# EAGLE design SSTuinoII_Jig (EAGLE 9.6.2)
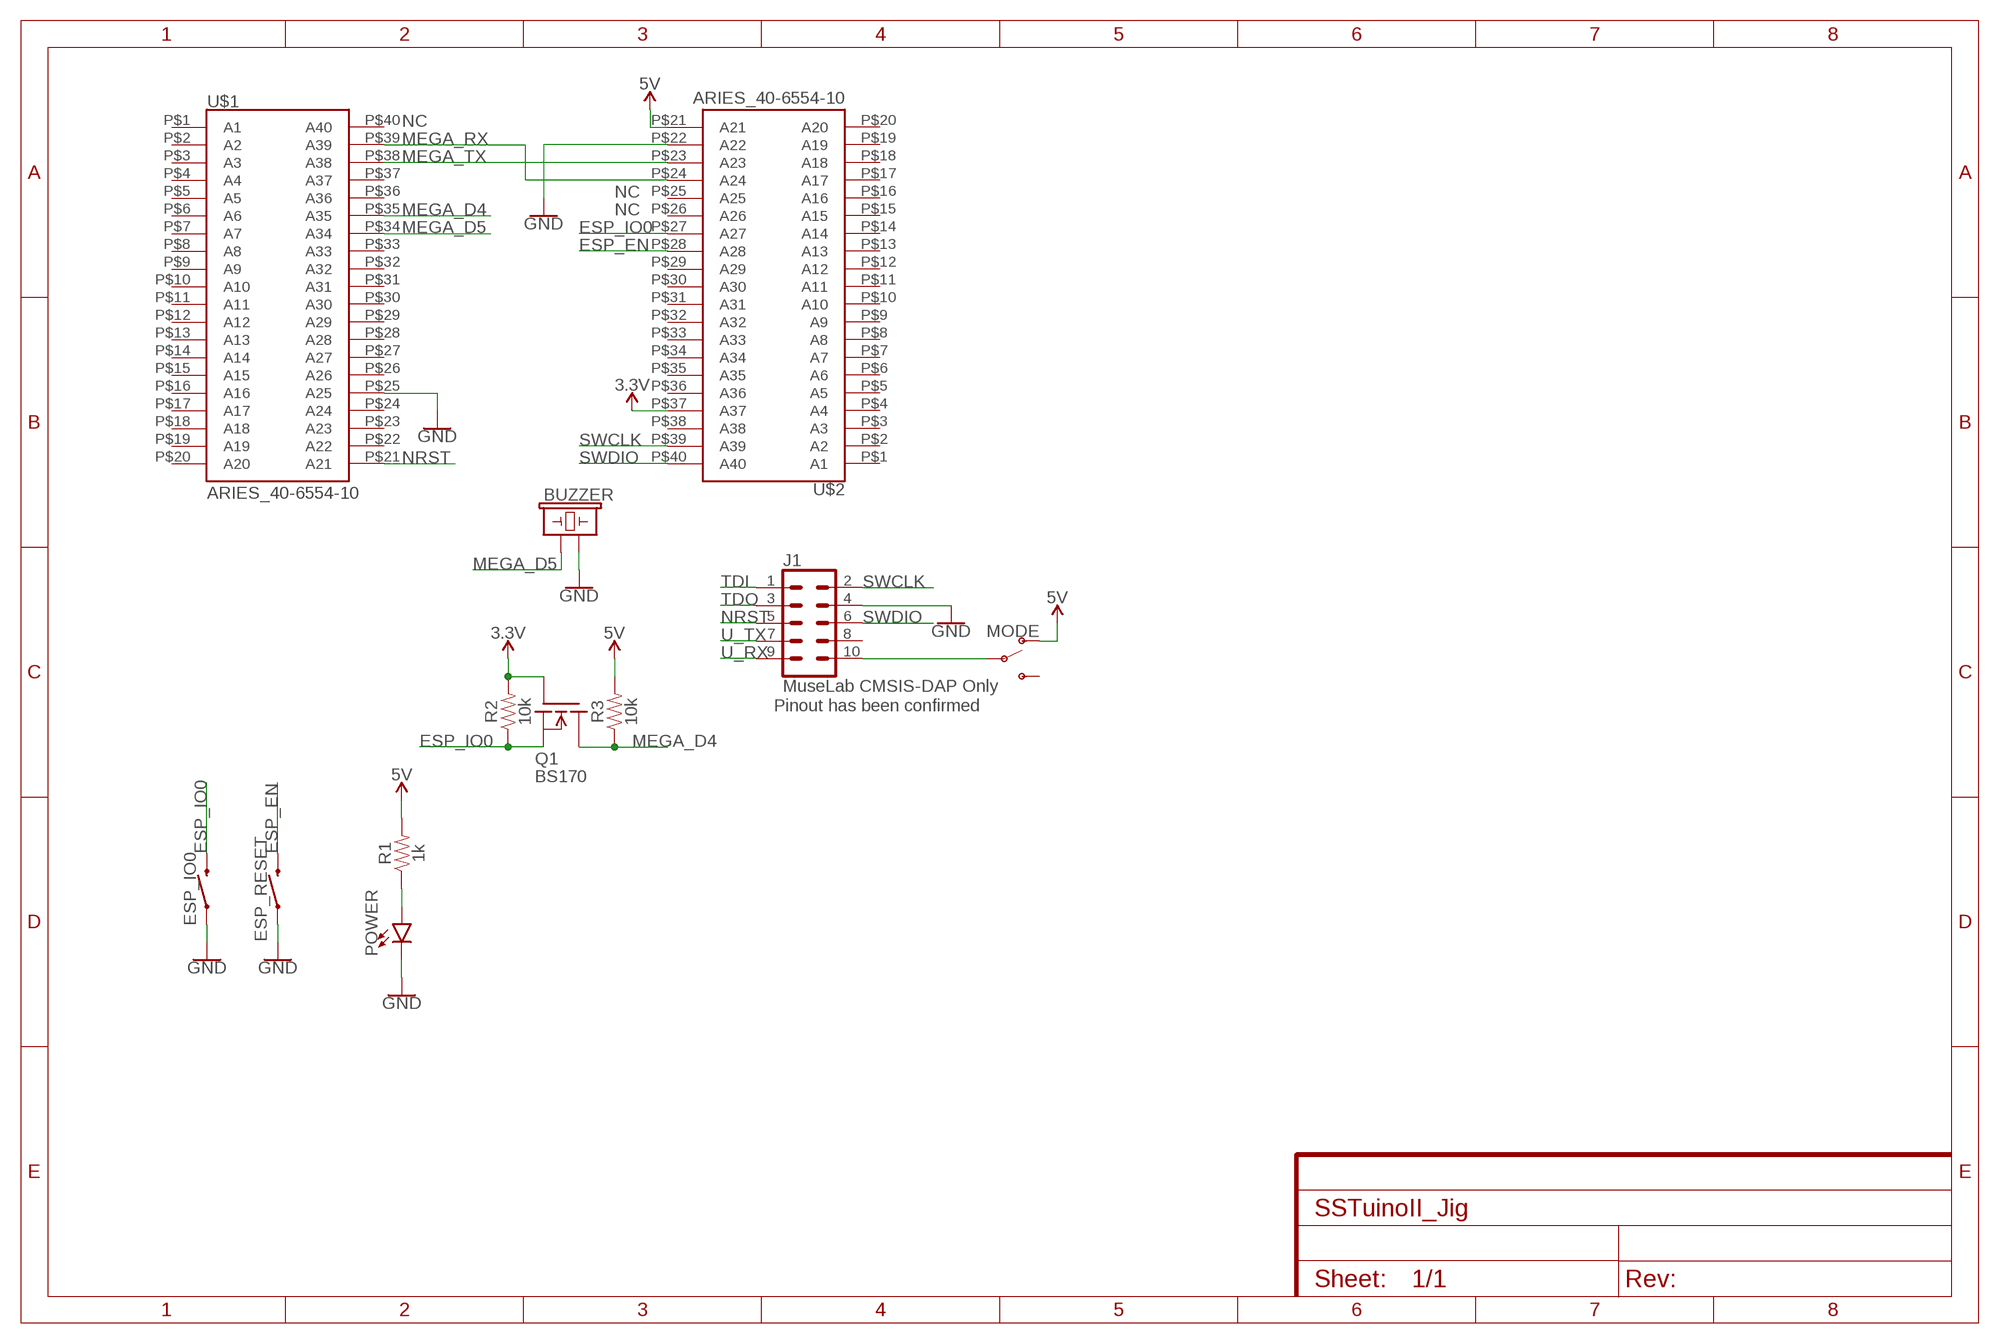
[diagram p0: schematic, sheet 1]

## Parts
BUZZER  BUZZER-PTH_KIT  [BUZZER-12MM-KIT]
ESP_IO0  MOMENTARY-SWITCH-SPST-PTH-6.0MM-KIT  [TACTILE_SWITCH_PTH_6.0MM_KIT]
ESP_RESET  MOMENTARY-SWITCH-SPST-PTH-6.0MM-KIT  [TACTILE_SWITCH_PTH_6.0MM_KIT]
J1  MuseLab CMSIS-DAP Only  CONN_05X2SHD_LOCK  [2X5-SHROUDED_LOCK]
MODE  SWITCH-SPDT-PTH-11.6X4.0MM-KIT  [SWITCH_SPDT_PTH_11.6X4.0MM_KIT]
POWER  LED3MM  [LED_3MM]
Q1  BS170  BSS101  [TO92]
R1  1k  1KOHM-HORIZ_KIT-1/4W-1%  [AXIAL-0.3-KIT]
R2  10k  10KOHM-HORIZ_KIT-1/4W-1%  [AXIAL-0.3-KIT]
R3  10k  10KOHM-HORIZ_KIT-1/4W-1%  [AXIAL-0.3-KIT]
U$1  ARIES_40-6554-10  [ARIES_40-6554-10]
U$2  ARIES_40-6554-10  [ARIES_40-6554-10]

## Nets
3.3V: Q1.2(G) R2.P$2 U$2.P$37(A37)
5V: MODE.1(O) R1.P$2 R3.P$2 U$2.P$21(A21)
ESP_EN: ESP_RESET.3 U$2.P$28(A28)
ESP_IO0: ESP_IO0.3 Q1.1(S) R2.P$1 U$2.P$27(A27)
GND: BUZZER.- ESP_IO0.1 ESP_RESET.1 J1.4 POWER.K(C) U$1.P$25(A25) U$2.P$22(A22)
MEGA_D4: Q1.3(D) R3.P$1 U$1.P$35(A35)
MEGA_D5: BUZZER.+ U$1.P$34(A34)
MEGA_RX: U$1.P$39(A39) U$2.P$24(A24)
MEGA_TX: U$1.P$38(A38) U$2.P$23(A23)
N$1: POWER.A R1.P$1
NRST: J1.5 U$1.P$21(A21)
PWR: J1.10 MODE.2(P)
SWCLK: J1.2 U$2.P$39(A39)
SWDIO: J1.6 U$2.P$40(A40)
TDI: J1.1
TDO: J1.3
U_RX: J1.9
U_TX: J1.7
Unconnected: J1.8 MODE.3(S) U$1.P$1(A1) U$1.P$2(A2) U$1.P$3(A3) U$1.P$4(A4) U$1.P$5(A5) U$1.P$6(A6) U$1.P$7(A7) U$1.P$8(A8) U$1.P$9(A9) U$1.P$10(A10) U$1.P$11(A11) U$1.P$12(A12) U$1.P$13(A13) U$1.P$14(A14) U$1.P$15(A15) U$1.P$16(A16) U$1.P$17(A17) U$1.P$18(A18) U$1.P$19(A19) U$1.P$20(A20) U$1.P$22(A22) U$1.P$23(A23) U$1.P$24(A24) U$1.P$26(A26) U$1.P$27(A27) U$1.P$28(A28) U$1.P$29(A29) U$1.P$30(A30) U$1.P$31(A31) U$1.P$32(A32) U$1.P$33(A33) U$1.P$36(A36) U$1.P$37(A37) U$1.P$40(A40) U$2.P$1(A1) U$2.P$2(A2) U$2.P$3(A3) U$2.P$4(A4) U$2.P$5(A5) U$2.P$6(A6) U$2.P$7(A7) U$2.P$8(A8) U$2.P$9(A9) U$2.P$10(A10) U$2.P$11(A11) U$2.P$12(A12) U$2.P$13(A13) U$2.P$14(A14) U$2.P$15(A15) U$2.P$16(A16) U$2.P$17(A17) U$2.P$18(A18) U$2.P$19(A19) U$2.P$20(A20) U$2.P$25(A25) U$2.P$26(A26) U$2.P$29(A29) U$2.P$30(A30) U$2.P$31(A31) U$2.P$32(A32) U$2.P$33(A33) U$2.P$34(A34) U$2.P$35(A35) U$2.P$36(A36) U$2.P$38(A38)

## Notes on the sheet
- NC
- NC
- NC
- Pinout has been confirmed

## Library data of the parts
BUZZER = SparkFun-Electromechanical:BUZZER: Buzzer Small round buzzers that operate around the audible 2kHz range. You can use these as speakers to create simple music or user interfaces. Variant Overview: PTH - Mini Speaker - PC Mount 12mm 2.048kHz <https://www.sparkfun.com/products/7950> PTH_KIT - Mini Speaker - PC Mount 12mm 2.048kHz <https://www.sparkfun.com/products/7950> KIT simplifies soldering by adding stop mask to one side of the pads. PTH_NO_SILK - Mini Speaker - PC Mount 12mm 2.048kHz <https://www.sparkfun.com/products/7950> No silkscreen indicator of buzzer outline. PTH_KIT_NO_SILK - Mini Speaker - PC Mount 12mm 2.048kHz <https://www.sparkfun.com/products/7950> KIT package w/o silkscreen SMD - Buzzer Audio Magnetic (CCV-084B16) SMD buzzer used on, e.g. the LilyPad Buzzer <https://www.sparkfun.com/products/8463> and RFID USB Reader <https://www.sparkfun.com/products/9963>. SMD_KIT - Buzzer Audio Magnetic (CCV-084B16) SMD Buzzer with elongated pins to make soldering easier. Used on the SparkFun Simon Says - Surface Mount Soldering Kit <https://www.sparkfun.com/products/10935>.; PROD_ID: COMP-08253; SF_SKU: COM-07950
ESP_IO0 ESP_RESET = SparkFun-Switches:MOMENTARY-SWITCH-SPST: Momentary Switch (Pushbutton) - SPST Normally-open (NO) SPST momentary switches (buttons, pushbuttons). Variants PTH-12MM - 12mm square, through-hole Momentary Pushbutton Switch - 12mm Square <https://www.sparkfun.com/products/9190> (COM-09190) PTH-6.0MM, PTH-6.0MM-KIT - 6.0mm square, through-hole Mini Pushbutton Switch <https://www.sparkfun.com/products/97> (COM-00097) KIT package intended for soldering kit's - only one side of pads' copper is exposed. PTH-RIGHT-ANGLE-KIT - Right-angle, through-hole Right Angle Tactile Button <https://www.sparkfun.com/products/10791> - Used on SparkFun BigTime Watch Kit <https://www.sparkfun.com/products/11734> SMD-12MM - 12mm square, surface-mount Tactile Button - SMD (12mm) <https://www.sparkfun.com/products/12993> (COM-12993) Used on SparkFun PicoBoard <https://www.sparkfun.com/products/11888> SMD-4.5MM - 4.5mm Square Trackball Switch Used on SparkFun Blackberry Trackballer Breakout <https://www.sparkfun.com/products/13169> SMD-4.6MMX2.8MM - 4.60mm x 2.80mm, surface mount Used on SparkFun SAMD21 Mini Breakout <https://www.sparkfun.com/products/13664> SMD-5.2MM, SMD-5.2-REDUNDANT - 5.2mm square, surface-mount Mini Pushbutton Switch - SMD <https://www.sparkfun.com/products/8720> (COM-08720) Used on Arduino Pro Mini <https://www.sparkfun.com/products/11114> REDUNDANT package connects both switch circuits together SMD-6.0X3.5MM - 6.0 x 3.5mm, surface mount Momentary Reset Switch SMD <https://www.sparkfun.com/products/8229> (COM-08229) SMD-6.2MM-TALL - 6.2mm square, surface mount Tactile Button - SMD (6mm) <https://www.sparkfun.com/products/12992> Used on SparkFun Digital Sandbox <https://www.sparkfun.com/products/12651> SMD-RIGHT-ANGLE - Right-angle, surface mount Used on SparkFun Block for Intel® Edison - Arduino <https://www.sparkfun.com/products/13036>; PROD_ID: SWCH-08441; SF_SKU: COM-00097
J1 = SparkFun-Connectors:CONN_05X2: Multi connection point. Often used as Generic Header-pin footprint for 0.1 inch spaced/style header connections For AVR SPI programming port, see special device with nice symbol: "AVR_SPI_PROG_5x2.dev" You can populate with any combo of single row headers, but if you'd like an exact match, check these: 2x5 AVR ICSP Male Header <https://www.sparkfun.com/products/778> (PRT-00778) 2x5 Pin Shrouded Header <https://www.sparkfun.com/products/8506> (PRT-08506) On any of the 0.1 inch spaced packages, you can populate with these: Break Away Headers - Straight <https://www.sparkfun.com/products/116> (PRT-00116) Break Away Male Headers - Right Angle <https://www.sparkfun.com/products/553> (PRT-00553) Female Headers <https://www.sparkfun.com/products/115> (PRT-00115) Break Away Headers - Machine Pin <https://www.sparkfun.com/products/117> (PRT-00117) Break Away Female Headers - Swiss Machine Pin <https://www.sparkfun.com/products/743> (PRT-00743) Special note: the shrouded connector mates well with our 5x2 ribbon cables: 2x5 Pin IDC Ribbon Cable <https://www.sparkfun.com/products/8535> (PRT-08535); PROD_ID: CONN-08671; SF_ID: PRT-08506
MODE = SparkFun-Switches:SWITCH-SPDT: Single Pole, Double Throw (SPDT) Switch Single-pole, double-throw (SPDT) switch. Variant Overview SMD-AYZ0202 Surface Mount DPDT Switch <https://www.sparkfun.com/products/597> (COM-00597) Used on e.g. LilyPad Arduino USB - ATmega32U4 Board <https://www.sparkfun.com/products/12049> PTH-11.6X4.0MM SPDT Mini Power Switch <https://www.sparkfun.com/products/102> (COM-00102) Used on e.g. SparkFun Simon Says - Through-Hole Soldering Kit <https://www.sparkfun.com/products/10547> (KIT-10547) PTH-11.6X4.0MM-KIT KIT version of SPDT Mini Power Switch - Simplifies soldering by removing tStop of switch pins - only one side can be soldered. PTH-11.6X4.0MM-LOCK LOCK version of SPDT Mini Power Switch - Offset pins hold switch in place for easier soldering. SMD-RIGHT-ANGLE Surface Mount Right Angle Switch <https://www.sparkfun.com/products/10860> (COM-10860) Used on e.g. SparkFun ESP8266 Thing <https://www.sparkfun.com/products/13231>; PROD_ID: SWCH-08261; SF_SKU: COM-00102
POWER = SparkFun-LED:LED: LED (Generic) Standard schematic elements and footprints for 5mm, 3mm, 1206, and 0603 sized LEDs. Generic LEDs with no color specified.; PROD_ID: DIO-08794
Q1 = transistor-fet:BSS101: N-Channel Enhancement MOSFET 200V; 0,16A; 11Ohm
R1 = SparkFun-Resistors:1KOHM: 1kΩ resistor A resistor is a passive two-terminal electrical component that implements electrical resistance as a circuit element. Resistors act to reduce current flow, and, at the same time, act to lower voltage levels within circuits. - Wikipedia; PROD_ID: RES-12182
R2 R3 = SparkFun-Resistors:10KOHM: 10kΩ resistor A resistor is a passive two-terminal electrical component that implements electrical resistance as a circuit element. Resistors act to reduce current flow, and, at the same time, act to lower voltage levels within circuits. - Wikipedia; PROD_ID: RES-12183
U$1 U$2 = D3ltav's Custom:ARIES_40-6554-10

## Board
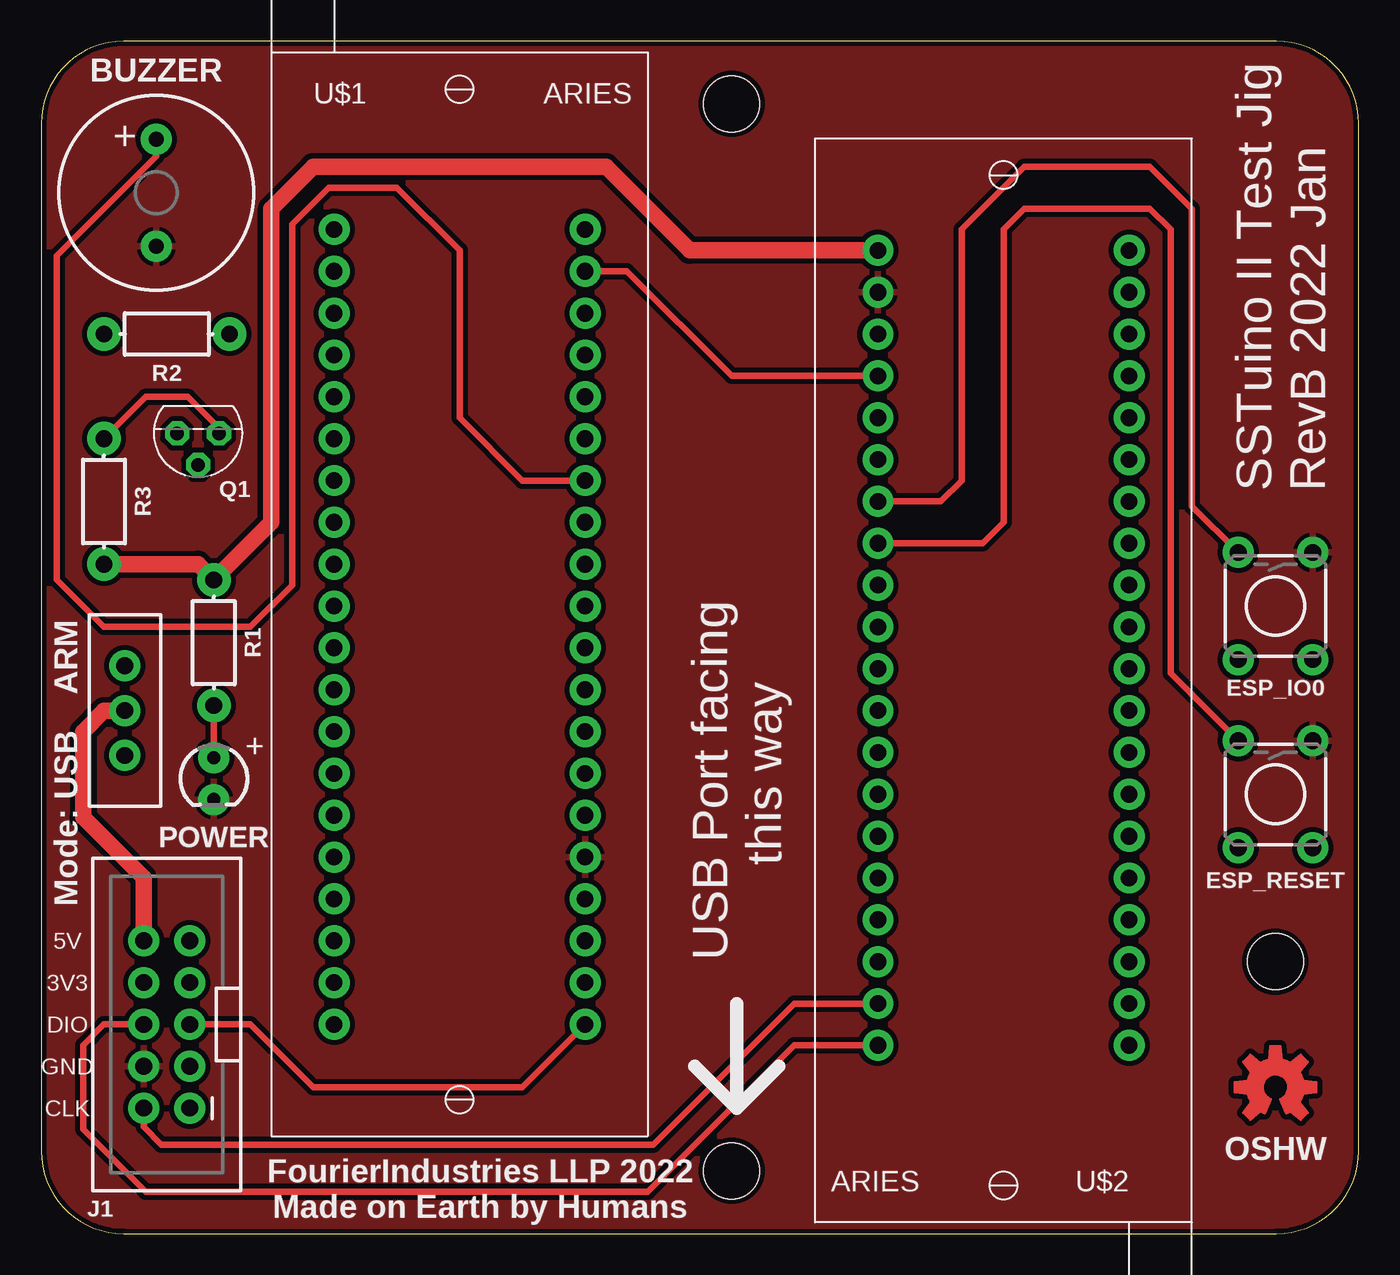
[diagram p1: board, top side]
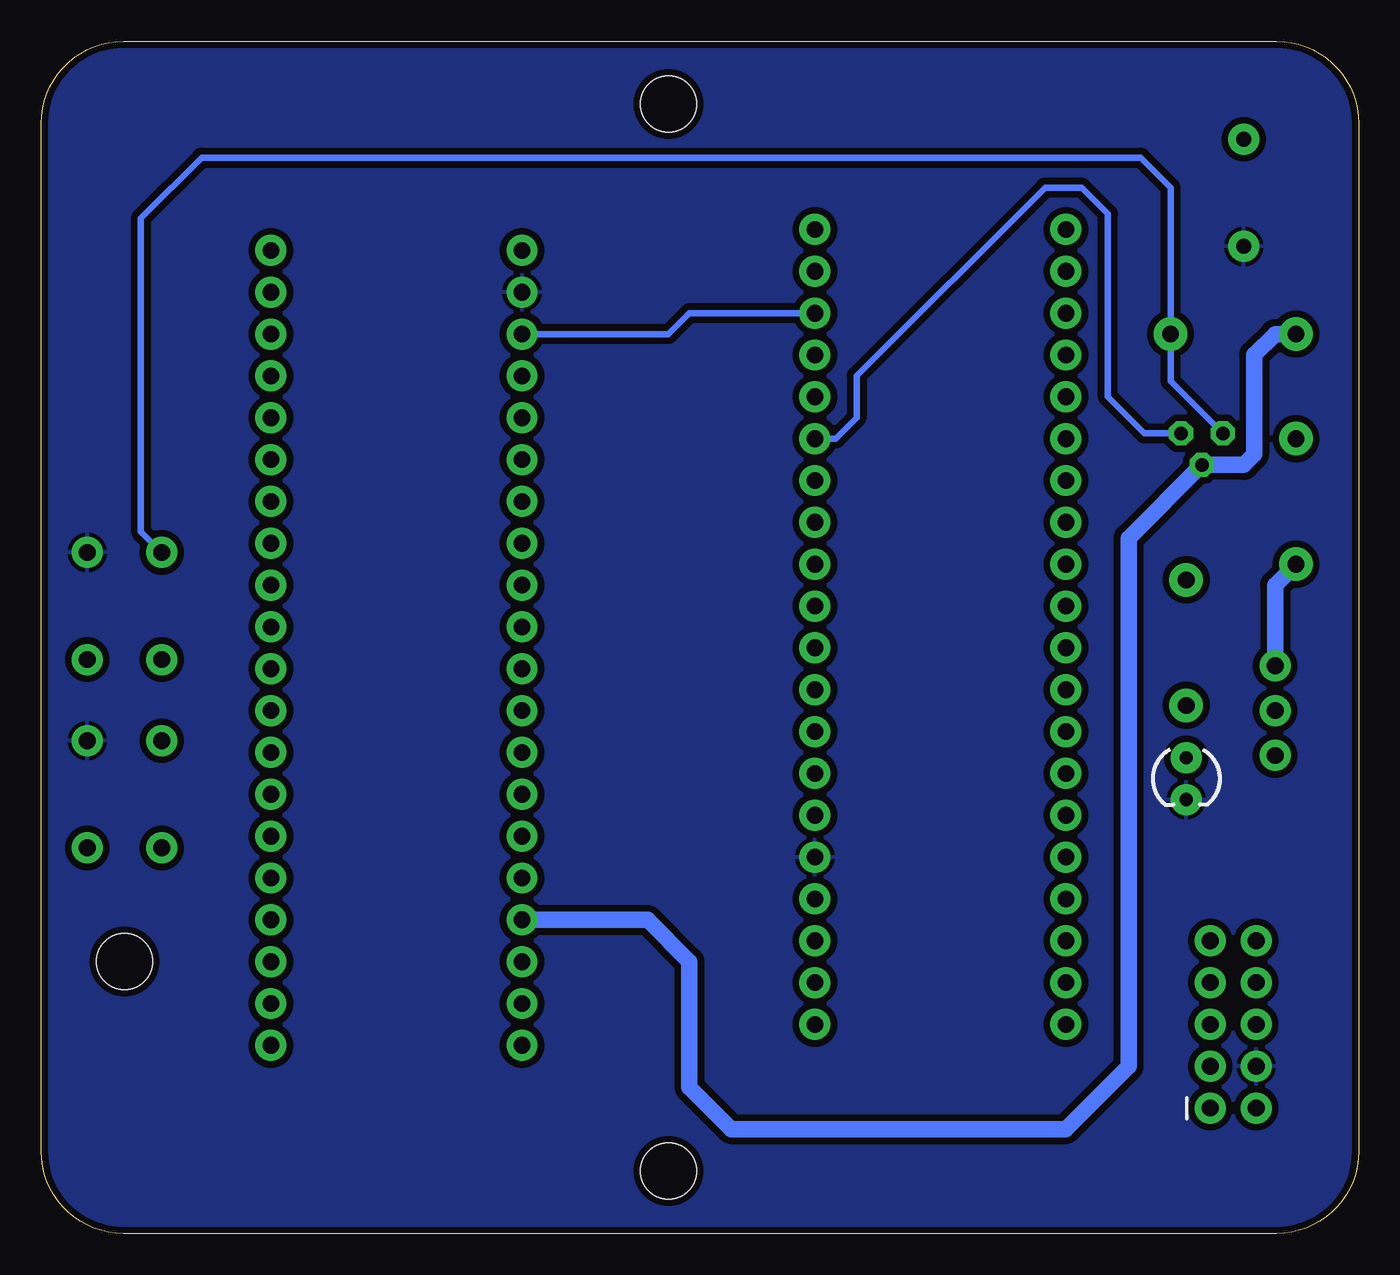
[diagram p2: board, bottom side, seen from below]

Size 79.99 x 72.39 mm. Coordinates in mm from the lower left corner, seen from the top.
Outline: 0,67.39 0,5 arc90 5,0 74.99,0 arc90 79.99,5 79.99,67.39 arc90 74.99,72.39 5,72.39 arc90 0,67.39
Copper layers (1*16): Top 0.035mm / dielectric 1.6mm / Bottom 0.035mm
Design rules "jlcpcb-2layers": minimum track width 5mil, minimum drill 0.3mm, track to track 5mil, track to pad 5mil, pad to pad 5mil, via to via 5mil, smd to smd 5mil, copper to edge 0.2mm, drill to drill 6mil, minimum pad ring 10mil, minimum via ring 3mil, stop-mask expansion 4mil, vias tented up to drill 0mil, thermal gap 10mil
Holes 3.4 mm at 41.91,68.58 41.91,3.81 74.93,16.51

### Footprints (pad centres in the part's own frame; a part is rotated, then mirrored left to right if it is on the bottom)
BUZZER-12MM-KIT = drill 0.9 pad 1.88: + 3.25,0; - -3.25,0
TACTILE_SWITCH_PTH_6.0MM_KIT = drill 1.016 pad 1.88: 1 -3.251,2.261; 2 3.251,2.261; 3 -3.251,-2.261; 4 3.251,-2.261
2X5-SHROUDED_LOCK = drill 1.016 pad 1.88: 1 -1.397,5.08; 2 1.397,5.08; 3 -1.397,2.54; 4 1.397,2.54; 5 -1.397,0; 6 1.397,0; 7 -1.397,-2.54; 8 1.397,-2.54; 9 -1.397,-5.08; 10 1.397,-5.08
SWITCH_SPDT_PTH_11.6X4.0MM_KIT = drill 1.016 pad 1.88: 1 0,2.718; 2 0,0; 3 0,-2.718
LED_3MM = drill 0.813 pad 1.88: A -1.27,0; K 1.27,0
TO92 = drill 0.813 octagon: 1 1.27,0; 2 0,1.905; 3 -1.27,0
AXIAL-0.3-KIT = drill 1.016 pad 2.032: P$1 -3.81,0; P$2 3.81,0
ARIES_40-6554-10 = drill 1.016 pad 1.88: P$1 0,0; P$2 0,-2.54; P$3 0,-5.08; P$4 0,-7.62; P$5 0,-10.16; P$6 0,-12.7; P$7 0,-15.24; P$8 0,-17.78; P$9 0,-20.32; P$10 0,-22.86; P$11 0,-25.4; P$12 0,-27.94; P$13 0,-30.48; P$14 0,-33.02; P$15 0,-35.56; P$16 0,-38.1; P$17 0,-40.64; P$18 0,-43.18; P$19 0,-45.72; P$20 0,-48.26; P$21 15.24,-48.26; P$22 15.24,-45.72; P$23 15.24,-43.18; P$24 15.24,-40.64; P$25 15.24,-38.1; P$26 15.24,-35.56; P$27 15.24,-33.02; P$28 15.24,-30.48; P$29 15.24,-27.94; P$30 15.24,-25.4; P$31 15.24,-22.86; P$32 15.24,-20.32; P$33 15.24,-17.78; P$34 15.24,-15.24; P$35 15.24,-12.7; P$36 15.24,-10.16; P$37 15.24,-7.62; P$38 15.24,-5.08; P$39 15.24,-2.54; P$40 15.24,0

### Placement (x,y rotation side)
BUZZER  6.99,63.18 90 top
ESP_IO0  74.93,38.1 270 top
ESP_RESET  74.93,26.67 270 top
J1  7.62,12.7 180 top
MODE  5.08,31.75 0 top
POWER  10.48,27.62 270 top
Q1  9.53,48.58 180 top
R1  10.48,35.88 90 top
R2  7.62,54.61 180 top
R3  3.81,44.45 270 top
U$1  17.78,60.96 0 top
U$2  66.04,11.43 180 top
U$3  [OSHW-LOGO-M_COPPER-SOLDERMASK]  74.93,8.89 0 top

### Tracks (layer width: path | path; a pad name or v marks a point on that pad's centre or on a via)
3.3V
  Bottom 1.016: U$2.P$37 43.18,19.05 40.64,16.51 40.64,8.89 38.1,6.35 17.78,6.35 13.97,10.16 13.97,42.23 Q1.2 6.99,46.67 6.35,47.31 6.35,53.34 5.08,54.61 R2.P$2
5V
  Top 1.016: R3.P$2 9.53,40.64 R1.P$2 13.97,43.18 13.97,49.53 13.97,62.23 16.51,64.77 34.29,64.77 39.37,59.69 U$2.P$21
  Bottom 1.016: R3.P$2 5.08,39.37 MODE.1
ESP_EN
  Top 0.406: ESP_RESET.3 68.58,34.01 68.58,60.96 67.31,62.23 59.69,62.23 58.42,60.96 58.42,43.18 57.15,41.91 U$2.P$28
ESP_IO0
  Top 0.406: ESP_IO0.3 69.85,44.17 69.85,62.23 67.31,64.77 59.69,64.77 55.88,60.96 55.88,45.72 54.61,44.45 U$2.P$27
  Bottom 0.406: ESP_IO0.3 73.94,42.62 73.94,61.63 70.25,65.32 13.25,65.32 11.43,63.5 R2.P$1 11.43,51.75 Q1.1
GND
  pour Top (isolate 0.305): 0,72.39 80.01,72.39 80.01,0 0,0
  pour Bottom (isolate 0.406): 0,72.39 80.01,72.39 80.01,0 0,0
MEGA_D4
  Top 0.406: R3.P$1 6.35,50.8 8.89,50.8 10.79,48.9 Q1.3
  Bottom 0.406: U$1.P$35 31.75,48.26 30.48,49.53 30.48,52.07 19.05,63.5 16.83,63.5 15.24,61.91 15.24,50.8 13.02,48.58 Q1.3
MEGA_D5
  Top 0.406: BUZZER.+ 6.99,65.41 0.95,59.37 0.95,39.69 3.81,36.83 12.7,36.83 15.24,39.37 15.24,61.28 17.46,63.5 21.59,63.5 25.4,59.69 25.4,49.53 29.21,45.72 U$1.P$34
MEGA_RX
  Top 0.406: U$1.P$39 35.56,58.42 41.91,52.07 U$2.P$24
MEGA_TX
  Bottom 0.406: U$1.P$38 40.64,55.88 41.91,54.61 U$2.P$23
N$1
  Top 0.406: POWER.A R1.P$1
NRST
  Top 0.406: U$1.P$21 29.21,8.89 16.51,8.89 12.7,12.7 J1.5
PWR
  Top 1.016: J1.10 6.22,21.59 2.54,25.27 2.54,30.48 3.81,31.75 MODE.2
SWCLK
  Top 0.406: U$2.P$39 45.72,13.97 37.15,5.4 7.3,5.4 6.22,6.48 J1.2
SWDIO
  Top 0.406: J1.6 3.81,12.7 2.54,11.43 2.54,6.35 6.35,2.54 36.83,2.54 45.72,11.43 U$2.P$40

### Text on the board
tPlace: + | SSTuino II Test Jig / RevB 2022 Jan | Mode: USB ARM | + | USB Port facing / this way | 5V | 3V3 | DIO | GND | CLK | OSHW | FourierIndustries LLP 2022 / Made on Earth by Humans